# EAGLE design Pi-Breakout (EAGLE 9.1.3)
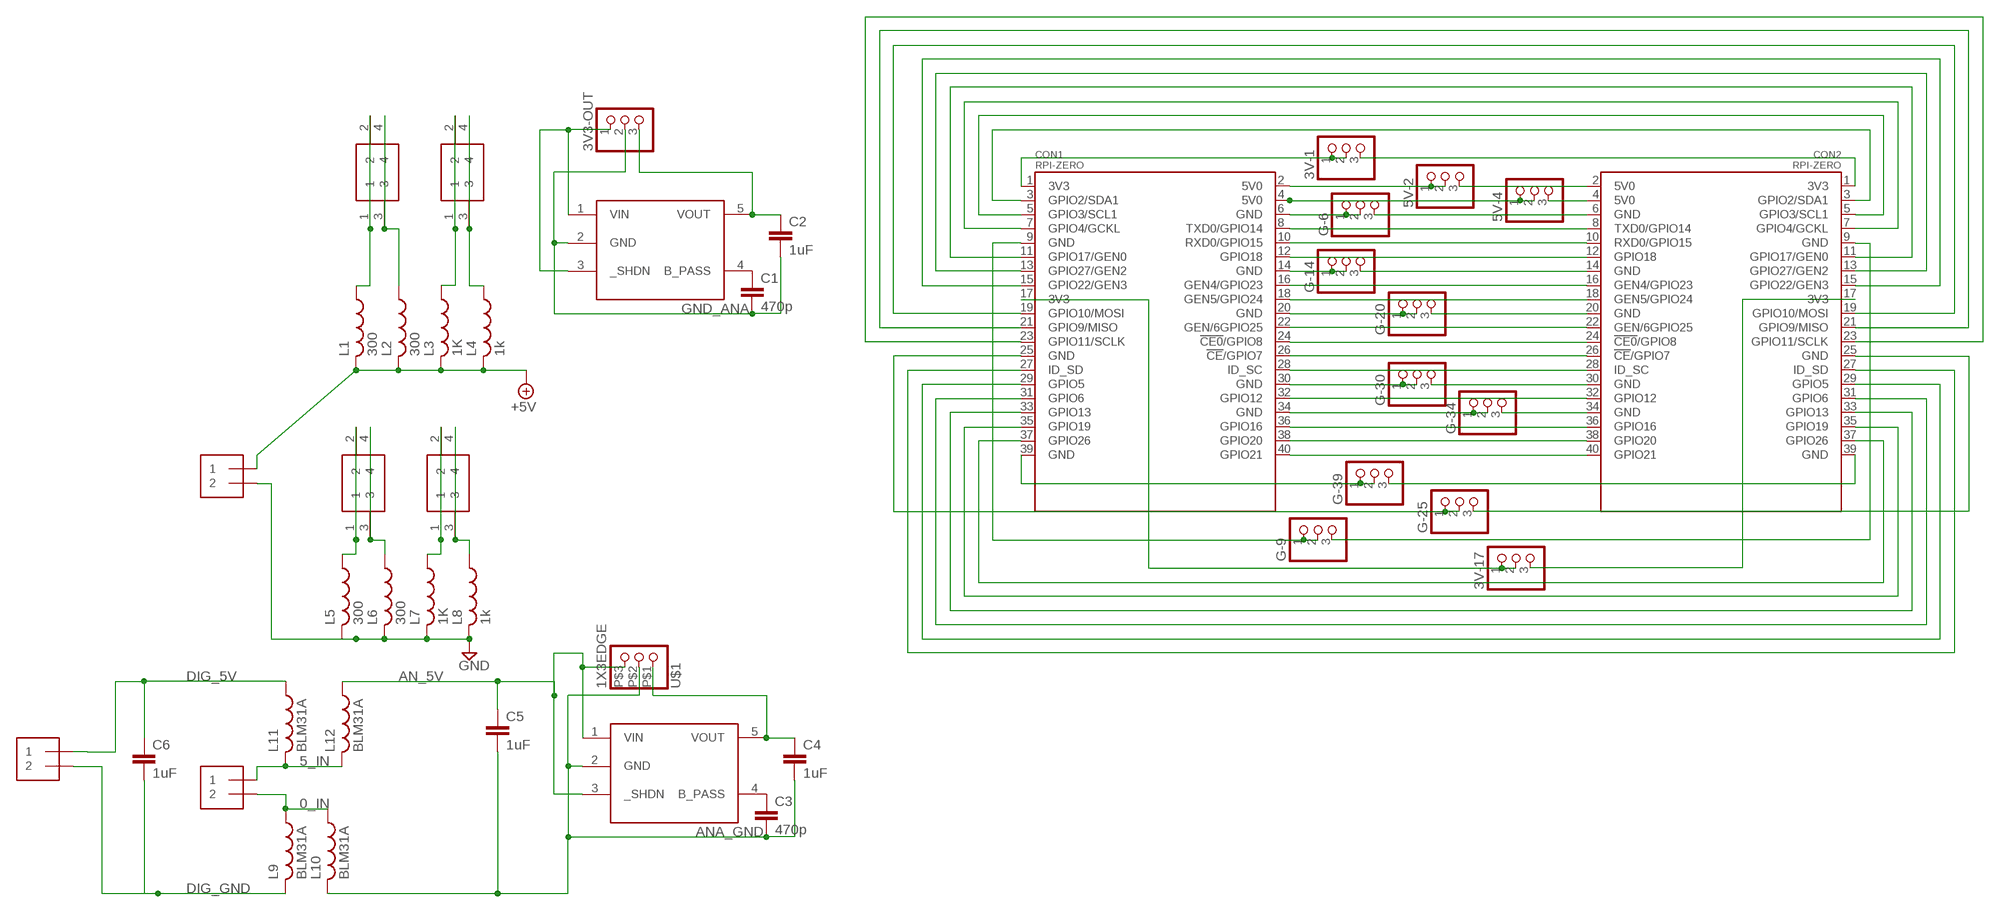
[diagram p0: schematic, sheet 1]

## Parts
3V3-OUT  PINHD-1X3  [1X03]
3V-1  PINHD-1X3  [1X03]
3V-17  PINHD-1X3  [1X03]
5V1  2X2HEADER  [2X2]
5V2  2X2HEADER  [2X2]
5V-2  PINHD-1X3  [1X03]
5V-4  PINHD-1X3  [1X03]
C1  470p  C-EUC0603  [C0603]
C2  1uF  C-EUC0603  [C0603]
C3  470p  C-EUC0603  [C0603]
C4  1uF  C-EUC0603  [C0603]
C5  1uF  C-EUC0603  [C0603]
C6  1uF  C-EUC0603  [C0603]
CON1  RPI-ZERO  [RASPBERRYPI_BASTELSTUBE_V13_RASPI_BOARD_B+_FULL]
CON2  RPI-ZERO  [RASPBERRYPI_BASTELSTUBE_V13_RASPI_BOARD_B+_FULL]
G-6  PINHD-1X3  [1X03]
G-9  PINHD-1X3  [1X03]
G-14  PINHD-1X3  [1X03]
G-20  PINHD-1X3  [1X03]
G-25  PINHD-1X3  [1X03]
G-30  PINHD-1X3  [1X03]
G-34  PINHD-1X3  [1X03]
G-39  PINHD-1X3  [1X03]
GND1  2X2HEADER  [2X2]
GND2  2X2HEADER  [2X2]
J1  2X1-LOCKING  [22-23-2021]
J2  1X2EDGE  [1X2_EDGE]
J3  1X2EDGE  [1X2_EDGE]
L1  300  BLM31A  [SML1206]
L2  300  BLM31A  [SML1206]
L3  1K  BLM31A  [SML1206]
L4  1k  BLM31A  [SML1206]
L5  300  BLM31A  [SML1206]
L6  300  BLM31A  [SML1206]
L7  1K  BLM31A  [SML1206]
L8  1k  BLM31A  [SML1206]
L9  BLM31A  [SML1206]
L10  BLM31A  [SML1206]
L11  BLM31A  [SML1206]
L12  BLM31A  [SML1206]
U1  TC1014-3.3V  [GHI-IC_SOT23-5(MICROCHIP)]
U2  TC1014-3.3V  [GHI-IC_SOT23-5(MICROCHIP)]
U$1  1X3EDGE  [1X3_EDGE]

## Nets
0_IN: J2.P$2 L9.A L10.A
3V3_1_B: 3V-1.1 3V-1.2 CON1.1(3V3)
3V3_1_PI: 3V-1.3 CON2.1(3V3)
3V3_17_B: 3V-17.1 3V-17.2 CON1.17(3V3)
3V3_17_PI: 3V-17.3 CON2.17(3V3)
5_IN: J2.P$1 L11.C L12.C
5V0_B: 5V-2.1 5V-2.2 CON1.2(5V0)
5V0_PI: 5V-2.3 CON2.2(5V0)
5V1_B: 5V-4.1 5V-4.2 CON1.4(5V0)
5V1_PI: 5V-4.3 CON2.4(5V0)
+5V: J1.1 L1.C L2.C L3.C L4.C
AN_5V: C5.1 L12.A U2.1(VIN) U2.3(_SHDN) U$1.P$3
ANA_GND: C3.2 C4.2 C5.2 L10.C U2.2(GND) U$1.P$2
DIG_5V: C6.1 J3.P$1 L11.A
DIG_GND: C6.2 J3.P$2 L9.C
GND: J1.2 L5.C L6.C L7.C L8.C
GND1: GND1.1 GND1.2 L5.A
GND@7: CON1.34(GND) G-34.1 G-34.2
GND_6_B: CON1.6(GND) G-6.1 G-6.2
GND_6_PI: CON2.6(GND) G-6.3
GND_9_B: CON1.9(GND) G-9.1 G-9.2
GND_9_PI: CON2.9(GND) G-9.3
GND_14_B: CON1.14(GND) G-14.1 G-14.2
GND_14_PI: CON2.14(GND) G-14.3
GND_20_B: CON1.20(GND) G-20.1 G-20.2
GND_20_PI: CON2.20(GND) G-20.3
GND_25_B: CON1.25(GND) G-25.1 G-25.2
GND_25_PI: CON2.25(GND) G-25.3
GND_30_B: CON1.30(GND) G-30.1 G-30.2
GND_30_PI: CON2.30(GND) G-30.3
GND_34_PI: CON2.34(GND) G-34.3
GND_39_B: CON1.39(GND) G-39.1 G-39.2
GND_39_PI: CON2.39(GND) G-39.3
GND_ANA: 3V3-OUT.2 C1.2 C2.2 U1.2(GND)
N$1: CON1.8(TXD0/GPIO14) CON2.8(TXD0/GPIO14)
N$2: CON1.10(RXD0/GPIO15) CON2.10(RXD0/GPIO15)
N$3: CON1.12(GPIO18) CON2.12(GPIO18)
N$4: CON1.16(GEN4/GPIO23) CON2.16(GEN4/GPIO23)
N$5: CON1.18(GEN5/GPIO24) CON2.18(GEN5/GPIO24)
N$6: CON1.22(GEN/6GPIO25) CON2.22(GEN/6GPIO25)
N$7: CON1.24(!CE0!/GPIO8) CON2.24(!CE0!/GPIO8)
N$8: CON1.26(!CE!/GPIO7) CON2.26(!CE!/GPIO7)
N$9: CON1.28(ID_SC) CON2.28(ID_SC)
N$10: CON1.32(GPIO12) CON2.32(GPIO12)
N$11: CON1.36(GPIO16) CON2.36(GPIO16)
N$12: CON1.38(GPIO20) CON2.38(GPIO20)
N$13: CON1.40(GPIO21) CON2.40(GPIO21)
N$14: CON1.3(GPIO2/SDA1) CON2.3(GPIO2/SDA1)
N$15: CON1.5(GPIO3/SCL1) CON2.5(GPIO3/SCL1)
N$16: CON1.7(GPIO4/GCKL) CON2.7(GPIO4/GCKL)
N$17: CON1.11(GPIO17/GEN0) CON2.11(GPIO17/GEN0)
N$18: CON1.13(GPIO27/GEN2) CON2.13(GPIO27/GEN2)
N$19: CON1.15(GPIO22/GEN3) CON2.15(GPIO22/GEN3)
N$20: CON1.19(GPIO10/MOSI) CON2.19(GPIO10/MOSI)
N$21: CON1.21(GPIO9/MISO) CON2.21(GPIO9/MISO)
N$22: CON1.23(GPIO11/SCLK) CON2.23(GPIO11/SCLK)
N$23: CON1.37(GPIO26) CON2.37(GPIO26)
N$24: CON1.35(GPIO19) CON2.35(GPIO19)
N$25: CON1.31(GPIO6) CON2.31(GPIO6)
N$26: CON1.33(GPIO13) CON2.33(GPIO13)
N$27: CON1.29(GPIO5) CON2.29(GPIO5)
N$28: CON1.27(ID_SD) CON2.27(ID_SD)
N$30: GND1.3 GND1.4 L6.A
N$31: GND2.1 GND2.2 L7.A
N$32: GND2.3 GND2.4 L8.A
N$33: 5V1.1 5V1.2 L1.A
N$34: 5V1.3 5V1.4 L2.A
N$35: 5V2.1 5V2.2 L3.A
N$36: 5V2.3 5V2.4 L4.A
N$37: 3V3-OUT.1 U1.1(VIN) U1.3(_SHDN)
N$38: C1.1 U1.4(B_PASS)
N$40: 3V3-OUT.3 C2.1 U1.5(VOUT)
N$42: C4.1 U2.5(VOUT) U$1.P$1
N$43: C3.1 U2.4(B_PASS)

## Library data of the parts
3V3-OUT 3V-1 3V-17 5V-2 5V-4 G-6 G-9 G-14 G-20 G-25 G-30 G-34 G-39 = adafruit:PINHD-1X3: PIN HEADER
5V1 5V2 GND1 GND2 = HappyBrackets:2X2HEADER: 2x2 2.54mm header
C1-C6 = rcl:C-EU: CAPACITOR, European symbol; SPICEPREFIX: C
CON1 CON2 = RPI-Zero:RPI-ZERO: Adafruit GPIO Header for Raspberry Pi HAT - 2x20 Short Female Header; MPN: ADA2243
J1 = HappyBrackets:2X1-LOCKING: 2x1 Locking Header https://www.molex.com/pdm_docs/sd/022272021_sd.pdf; DIGIKEY: WM4200-ND; MPN: 22-23-2021
J2 J3 = HappyBrackets:1X2EDGE: A 2 pin edge on top panel so you can SMD solder wire to it
L1-L12 = HappyBrackets:BLM31A: SMD 1206 Ferrite Filters- BLM31A Series BLM series ferrite beads from Murata do not require a ground connection and are ideal for use in circuits with unstable ground lines. These ferrite beads are designed to function nearly as resistors at noise frequencies, leaving signal wave forms undistorted and reducing the possibility of resonance. The nickel barrier construction of the external electrodes enables excellent solder heat resistance
U1 U2 = HappyBrackets:TC1014-3.3V
U$1 = HappyBrackets:1X3EDGE: 1 x 3 Pin SMD header

## Board
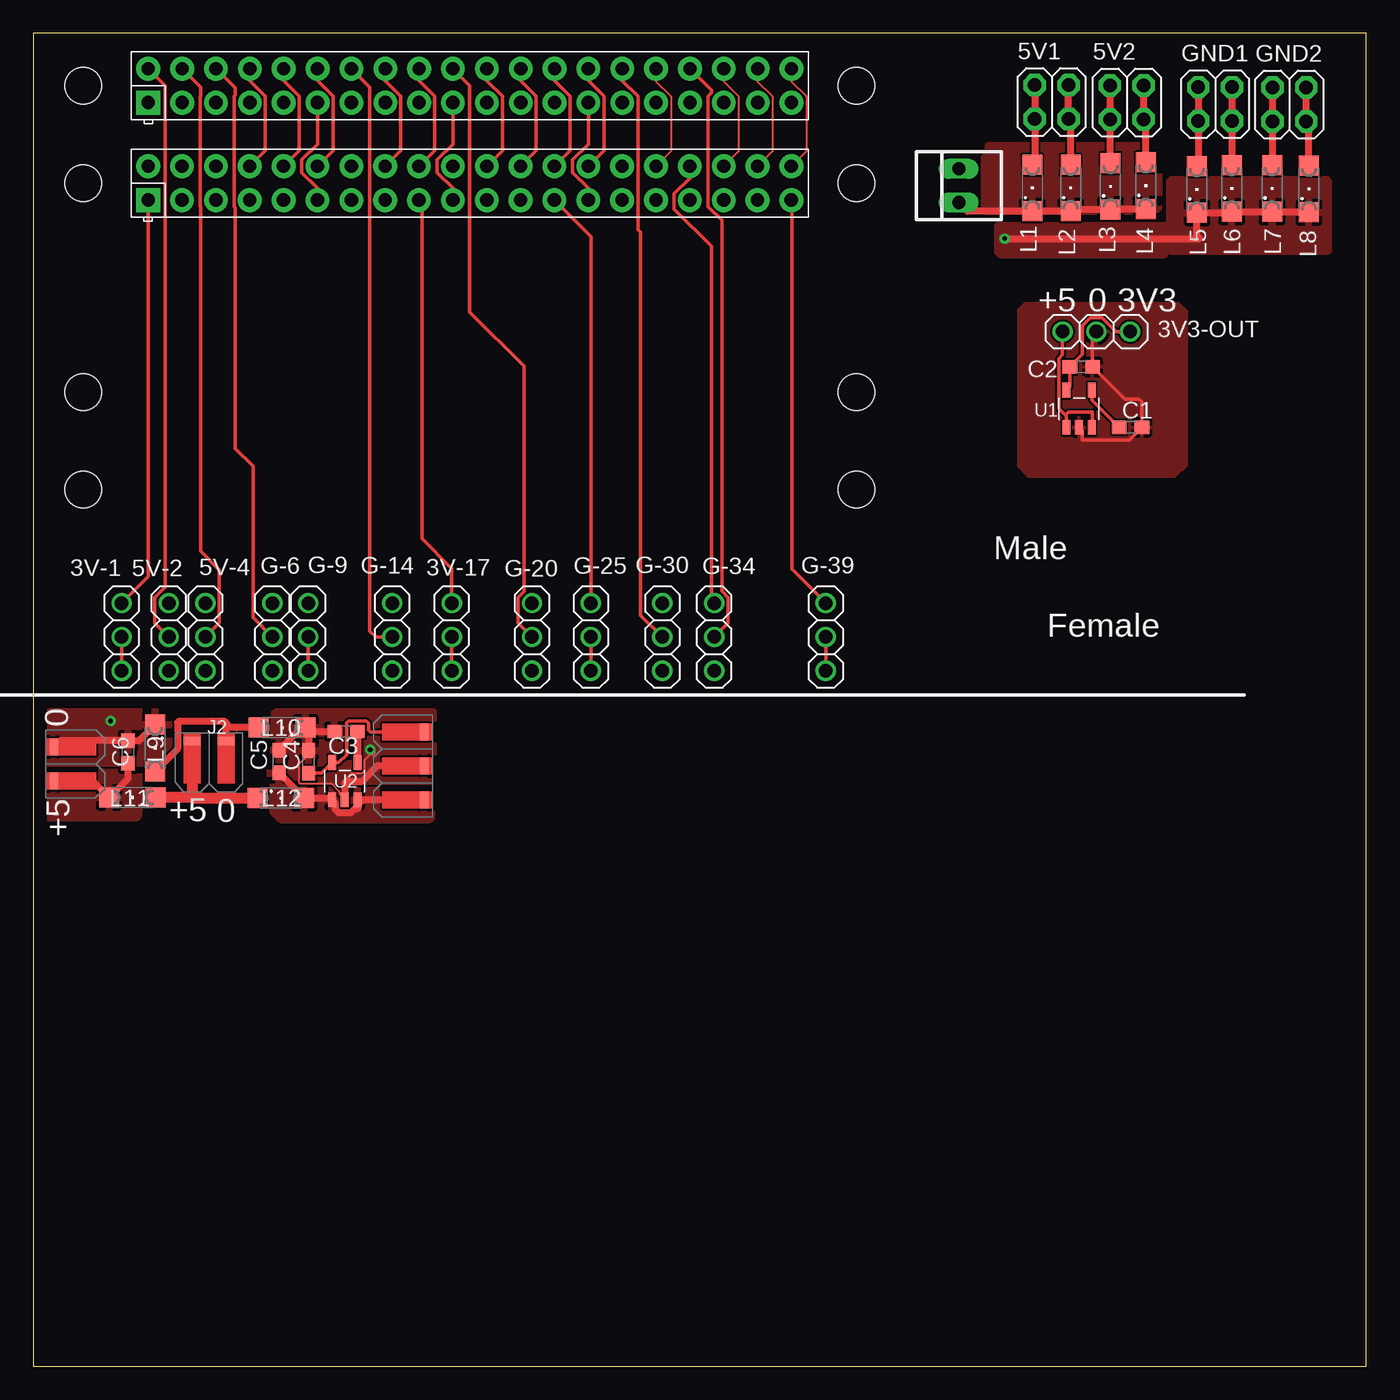
[diagram p1: board, top side]
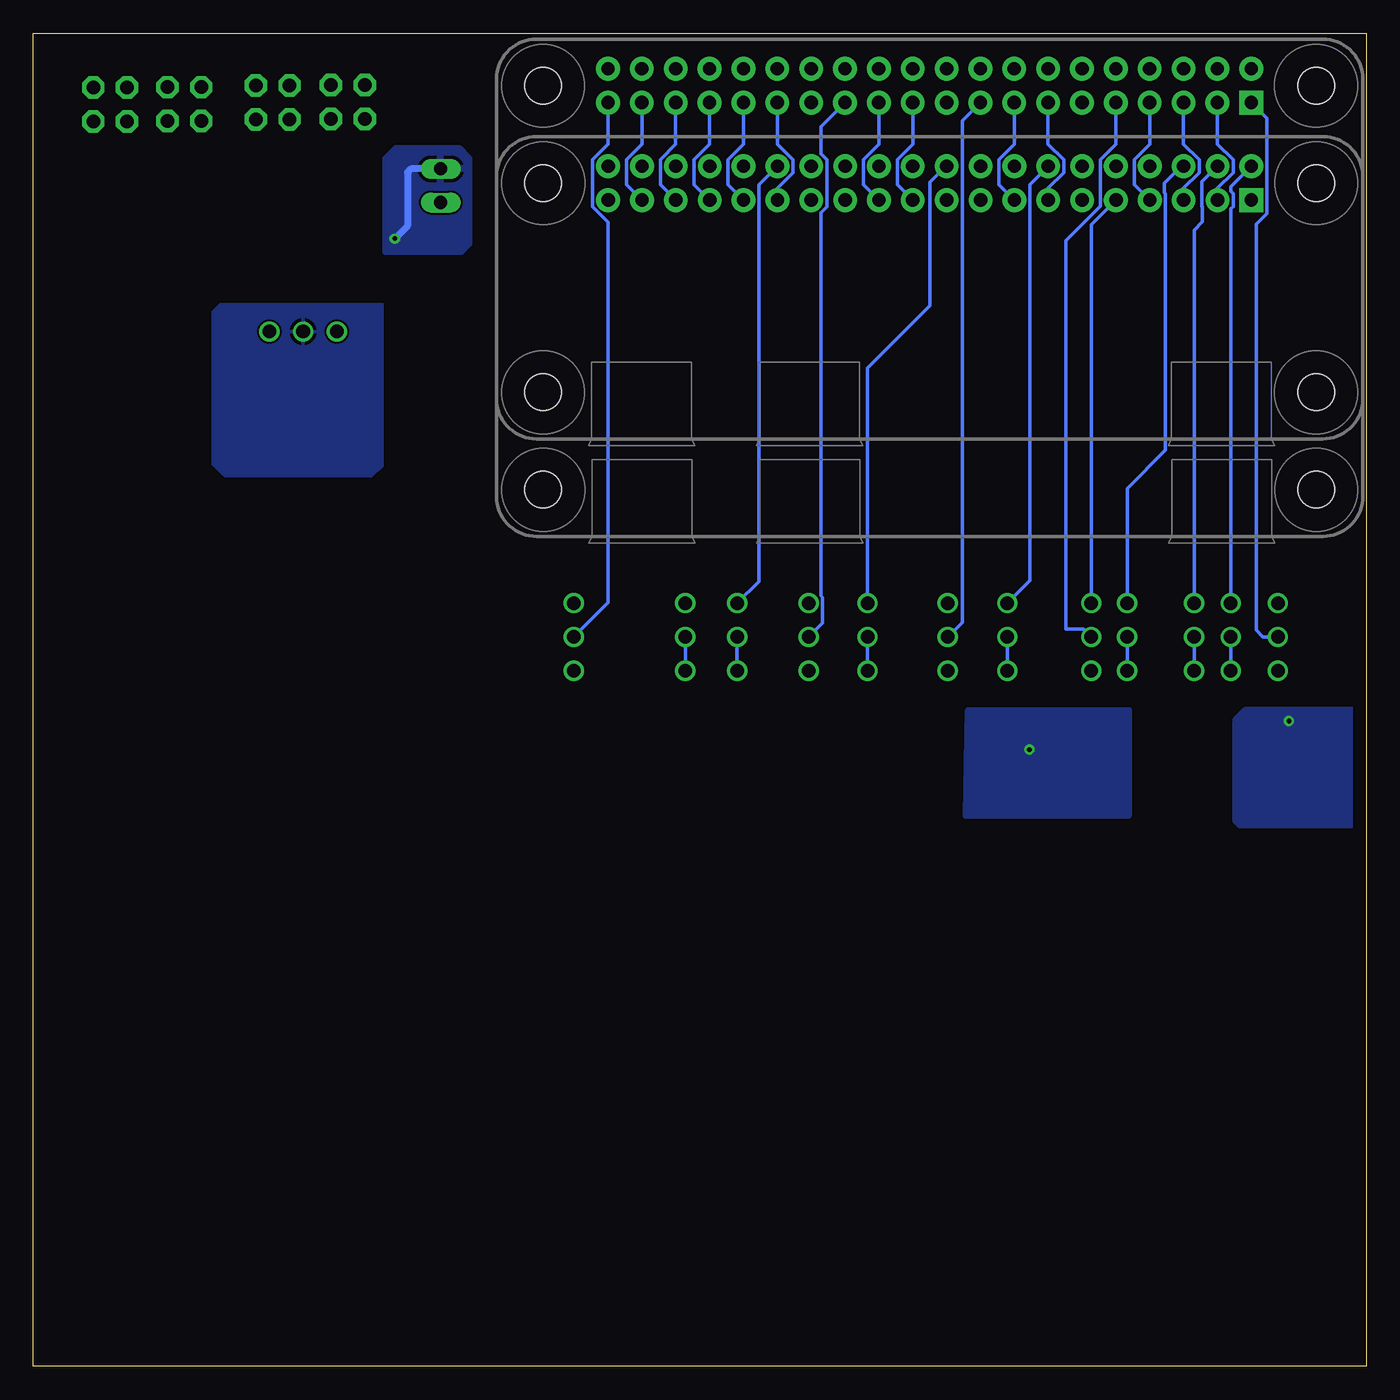
[diagram p2: board, bottom side, seen from below]

Size 100 x 100 mm. Coordinates in mm from the lower left corner, seen from the top.
Outline: 0,0 100,0 100,100 0,100 0,0
Copper layers (1*16): Top 0.035mm / dielectric 1.5mm / Bottom 0.035mm
Design rules "default": minimum track width 6mil, minimum drill 0.35mm, track to track 6mil, track to pad 6mil, pad to pad 6mil, via to via 6mil, smd to smd 6mil, copper to edge 40mil, drill to drill 6mil, minimum pad ring 10mil, minimum via ring 8mil, stop-mask expansion 4mil, vias tented up to drill 0mil, thermal gap 10mil

### Footprints (pad centres in the part's own frame; a part is rotated, then mirrored left to right if it is on the bottom)
1X03 = drill 1.016: 1 -2.54,0; 2 0,0; 3 2.54,0
2X2 = drill 1.016 pad 1.676 octagon: 1 -3.81,-1.27; 2 -3.81,1.27; 3 -1.27,-1.27; 4 -1.27,1.27
C0603 = smd 1.1 x 1: 1 -0.85,0; 2 0.85,0
RASPBERRYPI_BASTELSTUBE_V13_RASPI_BOARD_B+_FULL = drill 1 pad 1.778 square: 1 8.37,25.23 | drill 1 pad 1.778: 2 8.37,27.77; 3 10.91,25.23; 4 10.91,27.77; 5 13.45,25.23; 6 13.45,27.77; 7 15.99,25.23; 8 15.99,27.77; 9 18.53,25.23; 10 18.53,27.77; 11 21.07,25.23; 12 21.07,27.77; 13 23.61,25.23; 14 23.61,27.77; 15 26.15,25.23; 16 26.15,27.77; 17 28.69,25.23; 18 28.69,27.77; 19 31.23,25.23; 20 31.23,27.77; 21 33.77,25.23; 22 33.77,27.77; 23 36.31,25.23; 24 36.31,27.77; 25 38.85,25.23; 26 38.85,27.77; 27 41.39,25.23; 28 41.39,27.77; 29 43.93,25.23; 30 43.93,27.77; 31 46.47,25.23; 32 46.47,27.77; 33 49.01,25.23; 34 49.01,27.77; 35 51.55,25.23; 36 51.55,27.77; 37 54.09,25.23; 38 54.09,27.77; 39 56.63,25.23; 40 56.63,27.77 | hole 2.75: 3.5,3.5; 3.5,26.5; 61.5,3.5; 61.5,26.5
22-23-2021 = drill 1 long: 1 -1.27,0; 2 1.27,0
1X2_EDGE = smd 1.27 x 0.635: P$1 -1.27,1.27; P$2 1.27,1.27
SML1206 = smd 1.5 x 1.5: A 1.75,0; C -1.75,0
GHI-IC_SOT23-5(MICROCHIP) = smd 0.6 x 1.1: 1 -0.95,-1.4; 2 0,-1.4; 3 0.95,-1.4; 4 0.95,1.4; 5 -0.95,1.4
1X3_EDGE = smd 1.27 x 0.635: P$1 -2.54,1.27; P$2 0,1.27; P$3 2.54,1.27

### Placement (x,y rotation side)
3V3-OUT  79.76,77.62 0 top
3V-1  6.63,54.71 90 top
3V-17  31.39,54.71 90 top
5V1  78.94,94.84 0 top
5V2  84.58,94.82 0 top
5V-2  10.16,54.71 90 top
5V-4  12.91,54.71 90 top
C1  82.32,70.43 0 top
C2  78.61,74.98 0 top
C3  23.47,47.62 180 top
C4  20.65,45.34 90 top
C5  18.44,45.36 90 top
C6  7.11,46.08 90 top
CON1  0.25,69.57 0 top
CON2  0.24,62.26 0 top
G-6  17.93,54.71 90 top
G-9  20.62,54.71 90 top
G-14  26.92,54.71 90 top
G-20  37.41,54.71 90 top
G-25  41.83,54.71 90 top
G-30  47.19,54.71 90 top
G-34  51.08,54.71 90 top
G-39  59.46,54.71 90 top
GND1  91.21,94.69 0 top
GND2  96.77,94.67 0 top
J1  69.44,88.57 90 top
J2  13.18,45.62 0 top
J3  2.82,45.19 90 top
L1  74.96,88.39 90 top
L2  77.83,88.39 90 top
L3  80.82,88.52 90 top
L4  83.46,88.57 90 top
L5  87.3,88.29 90 top
L6  89.92,88.37 90 top
L7  92.94,88.37 90 top
L8  95.71,88.32 90 top
L9  9.14,46.38 270 top
L10  18.67,47.9 180 top
L11  7.44,42.67 180 top
L12  18.57,42.62 0 top
U1  78.46,71.83 0 top
U2  23.37,43.89 0 top
U$1  28.07,45.03 270 top

### Tracks (layer width: path | path; a pad name or v marks a point on that pad's centre or on a via)
0_IN
  Top 0.508: J2.P$2 14.45,48.26 | 14.45,48.26 14.33,48.39 10.92,48.39 10.82,48.28 10.82,46.31 L9.A | L10.A 15.28,47.9 15.26,47.93 14.78,47.93 14.45,48.26
3V3_1_B
  Top 0.254: 3V-1.1 3V-1.2
  Bottom 0.254: CON1.1 7.45,93.62 7.45,86.48 8.26,85.67 8.26,55.22 7.75,54.71 3V-1.2
3V3_1_PI
  Top 0.254: 3V-1.3 8.61,59.24 CON2.1
3V3_17_B
  Top 0.254: 3V-17.1 3V-17.2
  Bottom 0.254: CON1.17 30.3,93.44 30.3,55.8 3V-17.2
3V3_17_PI
  Top 0.254: 3V-17.3 31.39,59.84 29.16,62.08 29.16,87.26 CON2.17
5_IN
  Top 0.813: J2.P$1 11.91,42.77 | L11.C 11.81,42.67 11.91,42.77 | 11.91,42.77 12.06,42.62 L12.C
5V0_B
  Top 0.254: CON1.2 9.91,96.06 9.91,58.47 9.12,57.68 9.12,55.75 5V-2.2
  Bottom 0.254: 5V-2.1 5V-2.2
5V0_PI
  Bottom 0.254: CON2.2 10.16,88.48 10.16,88.15 9.99,87.97 9.99,87 10.16,86.83 5V-2.3
5V1_B
  Top 0.254: CON1.4 12.55,95.96 12.55,95.3 12.53,95.28 12.53,87 12.55,86.98 12.55,61.14 13.95,59.73 13.95,55.75 5V-4.2
  Bottom 0.254: 5V-4.1 5V-4.2
5V1_PI
  Bottom 0.254: 5V-4.3 12.91,85.23 12.29,85.85 12.29,86.97 12.32,87 12.32,88.86 CON2.4
+5V
  Top 0.508: L4.C 80.87,86.82 L3.C 77.95,86.77 L2.C L1.C 70.1,86.64 J1.1
  pour Top: 71.32,90.68 71.32,86.74 71.42,86.64 84.18,86.64 84.48,86.94 84.48,91.44 84.35,91.57 71.6,91.57 71.6,90.96
AN_5V
  Top 0.508: C5.1 20.32,42.64 L12.A 22.29,42.62 U2.1 22.66,42.25 22.66,41.77 22.9,41.53 23.84,41.53 24.16,41.86 24.38,41.86 24.38,42.14 | 24.38,42.14 24.38,42.42 U2.3 | U$1.P$3 24.74,42.49 24.38,42.14
  pour Top (rank 6): 17.73,44.81 17.73,41.81 18.52,41.02 29.77,41.02 29.92,41.17 29.92,43.69 29.84,43.76 20.62,43.76 19.53,44.86 19.48,44.81
ANA_GND  (via drill 0.35)
  Top 0.152: C4.2 20.65,45.86 19.92,45.13 19.92,43.84 20.06,43.71 22.37,43.71 22.95,43.14 22.95,42.91 U2.2 23.37,43.99 23.89,44.51 24.71,44.51 24.85,44.65 24.85,45.47 25.45,46.08
  Top 0.508: L10.C 20.13,47.9 C5.2 | L10.C 20.65,47.67 C4.2 | L10.C 20.7,47.62 C3.2 | U$1.P$2 25.81,45.03 24.61,43.84 23.44,43.84 23.37,43.76 U2.2 | 25.45,46.08 v25.27,46.25
  pour Top: 18.01,48.9 18.01,43.89 29.77,43.89 30.05,44.17 30.05,49.05 30,49.1 18.19,49.1 18.01,48.92
  pour Bottom: 18.92,49.2 17.83,49.2 17.83,41.33 30,41.3 29.83,49.2
DIG_5V
  Top 0.508: J3.P$1 4.45,43.92 L11.A 7.11,44.09 C6.1
  pour Top (rank 6): 0.58,45.19 7.47,45.19 7.9,44.75 7.9,41.27 7.77,41.15 0.56,41.15 0.53,41.17 0.53,45.14
DIG_GND  (via drill 0.35)
  Top 0.508: L9.C 7.94,46.93 C6.2 2.02,46.93 J3.P$2
  other vias: 5.79,48.41
  pour Top: 0.74,49.02 0.74,45.31 0.79,45.26 10.57,45.26 10.59,45.29 10.59,48.95 10.46,49.07 0.79,49.07 0.76,49.05
  pour Bottom: 0.46,49.23 0.46,41.02 0.86,40.61 9.47,40.61 9.75,40.89 9.75,48.51 9.6,48.67 9.04,49.23
GND  (via drill 0.35)
  Top 0.508: v72.87,84.61 87.5,84.61 87.3,84.81 L5.C 89.84,86.54 L6.C L7.C 95.66,86.62 L8.C
  Bottom 0.508: J1.2 71.65,89.84 71.93,89.56 71.93,85.55 v72.87,84.61
  pour Top: 85.22,88.82 85.22,83.74 85.32,83.64 97.1,83.64 97.18,83.72 97.18,88.9 97.05,89.03 85.39,89.03 85.22,88.85
  pour Top: 84.86,85.65 84.86,83.36 72.57,83.36 72.36,83.57 72.36,85.6 84.81,85.6
  pour Bottom: 67.34,90.6 67.34,84.2 67.92,83.62 73.51,83.62 73.53,83.59 73.53,90.63 72.8,91.36 68.07,91.36 67.34,90.63
GND1
  Top 0.508: GND1.2 GND1.1 87.4,90.14 L5.A
GND@7
  Top 0.254: CON1.34 50.89,95.71 50.89,95.54 50.63,95.28 50.63,87 51.66,85.97 51.66,58.14 52.12,57.68 52.12,55.75 G-34.2
  Bottom 0.254: G-34.1 G-34.2
GND_6_B
  Top 0.254: CON1.6 15.14,95.91 15.14,95.35 15.07,95.28 15.07,87 15.14,86.93 15.14,68.86 16.48,67.51 16.48,56.16 G-6.2
  Bottom 0.254: G-6.1 G-6.2
GND_6_PI
  Bottom 0.254: G-6.3 17.93,65.86 15.07,68.73 15.07,87.97 15.14,88.05 15.14,88.77 13.88,90.03 CON2.6
GND_9_B
  Top 0.254: G-9.1 G-9.2
  Bottom 0.254: CON1.9 18.78,91.67 19.94,90.51 19.94,87.04 22.53,84.45 22.53,55.3 21.21,55.3 G-9.2
GND_9_PI
  Bottom 0.254: G-9.3 20.62,85.64 CON2.9
GND_14_B
  Top 0.254: CON1.14 25.25,95.96 25.25,95.3 25.23,95.28 25.23,87 25.25,86.98 25.25,55.17 25.7,54.71 G-14.2
  Bottom 0.254: G-14.1 G-14.2
GND_14_PI
  Bottom 0.254: G-14.3 25.25,58.93 25.25,86.98 25.23,87 25.23,87.97 25.25,87.99 25.25,88.63 CON2.14
GND_20_B
  Top 0.254: CON1.20 32.74,96.08 32.74,79.1 36.8,75.03 36.8,58.12 36.37,57.68 36.37,55.75 G-20.2
  Bottom 0.254: G-20.1 G-20.2
GND_20_PI
  Bottom 0.254: G-20.3 37.41,74.88 32.74,79.55 32.74,88.85 31.56,90.03 CON2.20
GND_25_B
  Top 0.254: G-25.1 G-25.2
  Bottom 0.254: CON1.25 40.92,92.98 40.92,90.97 40.47,90.51 40.47,87 40.92,86.55 40.92,57.81 40.79,57.68 40.79,55.75 G-25.2
GND_25_PI
  Top 0.254: G-25.3 41.83,84.75 CON2.25
GND_30_B
  Top 0.254: CON1.30 44.18,96.45 45.35,95.28 45.35,85.28 45.57,85.06 45.57,56.34 G-30.2
  Bottom 0.254: G-30.1 G-30.2
GND_30_PI
  Bottom 0.254: G-30.3 45.57,58.88 45.57,86.98 45.55,87 45.55,87.97 45.57,87.99 45.57,88.63 CON2.30
GND_34_PI
  Top 0.254: CON2.34 49.25,89.14 48.09,87.97 48.09,86.81 50.88,84.02 50.88,57.45 G-34.3
GND_39_B
  Top 0.254: G-39.1 G-39.2
  Bottom 0.254: G-39.2 56.88,57.29 56.88,85.85 58.04,87 58.04,90.51 56.88,91.67 CON1.39
GND_39_PI
  Top 0.254: G-39.3 56.92,59.79 56.92,87.44 CON2.39
GND_ANA
  Top 0.254: 3V3-OUT.2 79.46,77.33 C2.2 81.88,72.57 82.96,72.57 83.17,72.35 C1.2 82.23,69.49 78.69,69.49 78.69,70.2 U1.2
  pour Top: 73.86,79.27 73.86,67.51 74.63,66.75 85.7,66.75 86.56,67.61 86.56,79.15 85.95,79.76 74.4,79.76 73.94,79.3 73.91,79.27
  pour Bottom: 73.81,79.68 73.81,67.54 74.63,66.73 74.73,66.73 85.62,66.73 85.72,66.83 86.51,67.61 86.56,67.61 86.54,67.64 86.54,79.15 85.95,79.73 73.84,79.73 73.81,79.71
N$1
  Top 0.254: CON1.8 16.24,96.45 17.41,95.28 17.41,91.21 CON2.8
N$2
  Top 0.254: CON1.10 18.78,96.45 19.95,95.28 19.95,91.21 CON2.10
N$3
  Top 0.254: CON1.12 21.32,96.45 22.49,95.28 22.49,91.21 CON2.12
N$4
  Top 0.254: CON1.16 26.4,96.45 27.57,95.28 27.57,91.21 CON2.16
N$5
  Top 0.254: CON1.18 28.94,96.45 30.11,95.28 30.11,91.21 CON2.18
N$6
  Top 0.254: CON1.22 34.02,96.45 35.19,95.28 35.19,91.21 CON2.22
N$7
  Top 0.254: CON1.24 36.56,96.45 37.73,95.28 37.73,91.21 CON2.24
N$8
  Top 0.254: CON1.26 39.1,96.45 40.27,95.28 40.27,91.21 CON2.26
N$9
  Top 0.254: CON1.28 41.64,96.45 42.81,95.28 42.81,91.21 CON2.28
N$10
  Top 0.152: CON1.32 46.72,96.38 47.84,95.26 47.84,91.16 CON2.32
N$11
  Top 0.152: CON1.36 51.8,96.38 52.92,95.26 52.92,91.16 CON2.36
N$12
  Top 0.152: CON1.38 54.34,96.38 55.46,95.26 55.46,91.16 CON2.38
N$13
  Top 0.152: CON1.40 56.88,96.38 58,95.26 58,91.16 CON2.40
N$14
  Bottom 0.254: CON2.3 11.16,87.5 11.16,88.37 9.99,89.54 9.99,90.51 11.16,91.69 CON1.3
N$15
  Bottom 0.254: CON2.5 13.7,87.5 13.7,88.37 12.53,89.54 12.53,90.51 13.7,91.69 CON1.5
N$16
  Bottom 0.254: CON1.7 16.24,91.67 17.4,90.51 17.4,88.66 CON2.7
N$17
  Top 0.254: CON2.11 21.32,87.5 21.32,88.37 20.15,89.54 20.15,90.51 21.32,91.69 CON1.11
N$18
  Bottom 0.254: CON2.13 23.86,87.5 23.86,88.37 22.69,89.54 22.69,90.51 23.86,91.69 CON1.13
N$19
  Bottom 0.254: CON1.15 26.4,91.67 27.56,90.51 27.56,88.66 CON2.15
N$20
  Top 0.254: CON2.19 31.48,87.5 31.48,88.37 30.31,89.54 30.31,90.51 31.48,91.69 CON1.19
N$21
  Bottom 0.254: CON1.21 34.02,91.67 35.18,90.51 35.18,88.66 CON2.21
N$22
  Bottom 0.254: CON1.23 36.56,91.67 37.72,90.51 37.72,88.66 CON2.23
N$23
  Bottom 0.254: CON1.37 54.34,91.67 55.5,90.51 55.5,88.66 CON2.37
N$24
  Bottom 0.254: CON1.35 51.8,91.67 52.96,90.51 52.96,88.66 CON2.35
N$25
  Bottom 0.254: CON1.31 46.72,91.67 47.88,90.51 47.88,88.66 CON2.31
N$26
  Bottom 0.254: CON1.33 49.26,91.67 50.42,90.51 50.42,88.66 CON2.33
N$27
  Bottom 0.254: CON2.29 44.18,87.5 44.18,88.37 43.01,89.54 43.01,90.51 44.18,91.69 CON1.29
N$28
  Top 0.254: CON2.27 41.64,87.5 41.64,88.37 40.47,89.54 40.47,90.51 41.64,91.69 CON1.27
N$30
  Top 0.508: L6.A 89.94,90.14 GND1.3 GND1.4
N$31
  Top 0.508: GND2.2 GND2.1 92.96,90.14 L7.A
N$32
  Top 0.508: L8.A 95.71,93.19 GND2.3 GND2.4
N$33
  Top 0.508: 5V1.2 5V1.1 75.13,90.32 L1.A
N$34
  Top 0.508: L2.A 77.83,93.42 5V1.3 5V1.4
N$35
  Top 0.508: 5V2.2 5V2.1 80.77,90.32 L3.A
N$36
  Top 0.508: L4.A 83.46,93.4 5V2.3 5V2.4
N$37
  Top 0.254: U1.3 79.45,70.47 79.45,71.58 77.67,71.58 77.44,71.35 | 77.44,71.35 77.51,71.28 U1.1 | 3V3-OUT.1 77.22,75.88 76.93,75.59 76.93,71.86 77.44,71.35
N$38
  Top 0.254: U1.4 79.41,72.5 C1.1
N$40
  Top 0.254: U1.5 77.76,73.48 C2.1 78.72,75.93 78.72,78.05 79.33,78.66 80.19,78.66 81.23,77.62 3V3-OUT.3
N$42
  Top 0.254: C4.1 21.62,44.49 U2.5 22.91,45.29 23.49,45.87 23.49,48.24 23.65,48.4 24.98,48.4 25.15,48.24 25.15,47.72 25.3,47.57 U$1.P$1
N$43
  Top 0.508: C3.1 U2.4

### Text on the board
tNames: +5 | 0 | 3V3 | Male | Female | 0 | +5 | 0 | +5